# EAGLE schematic project (EAGLE 9.6.2)
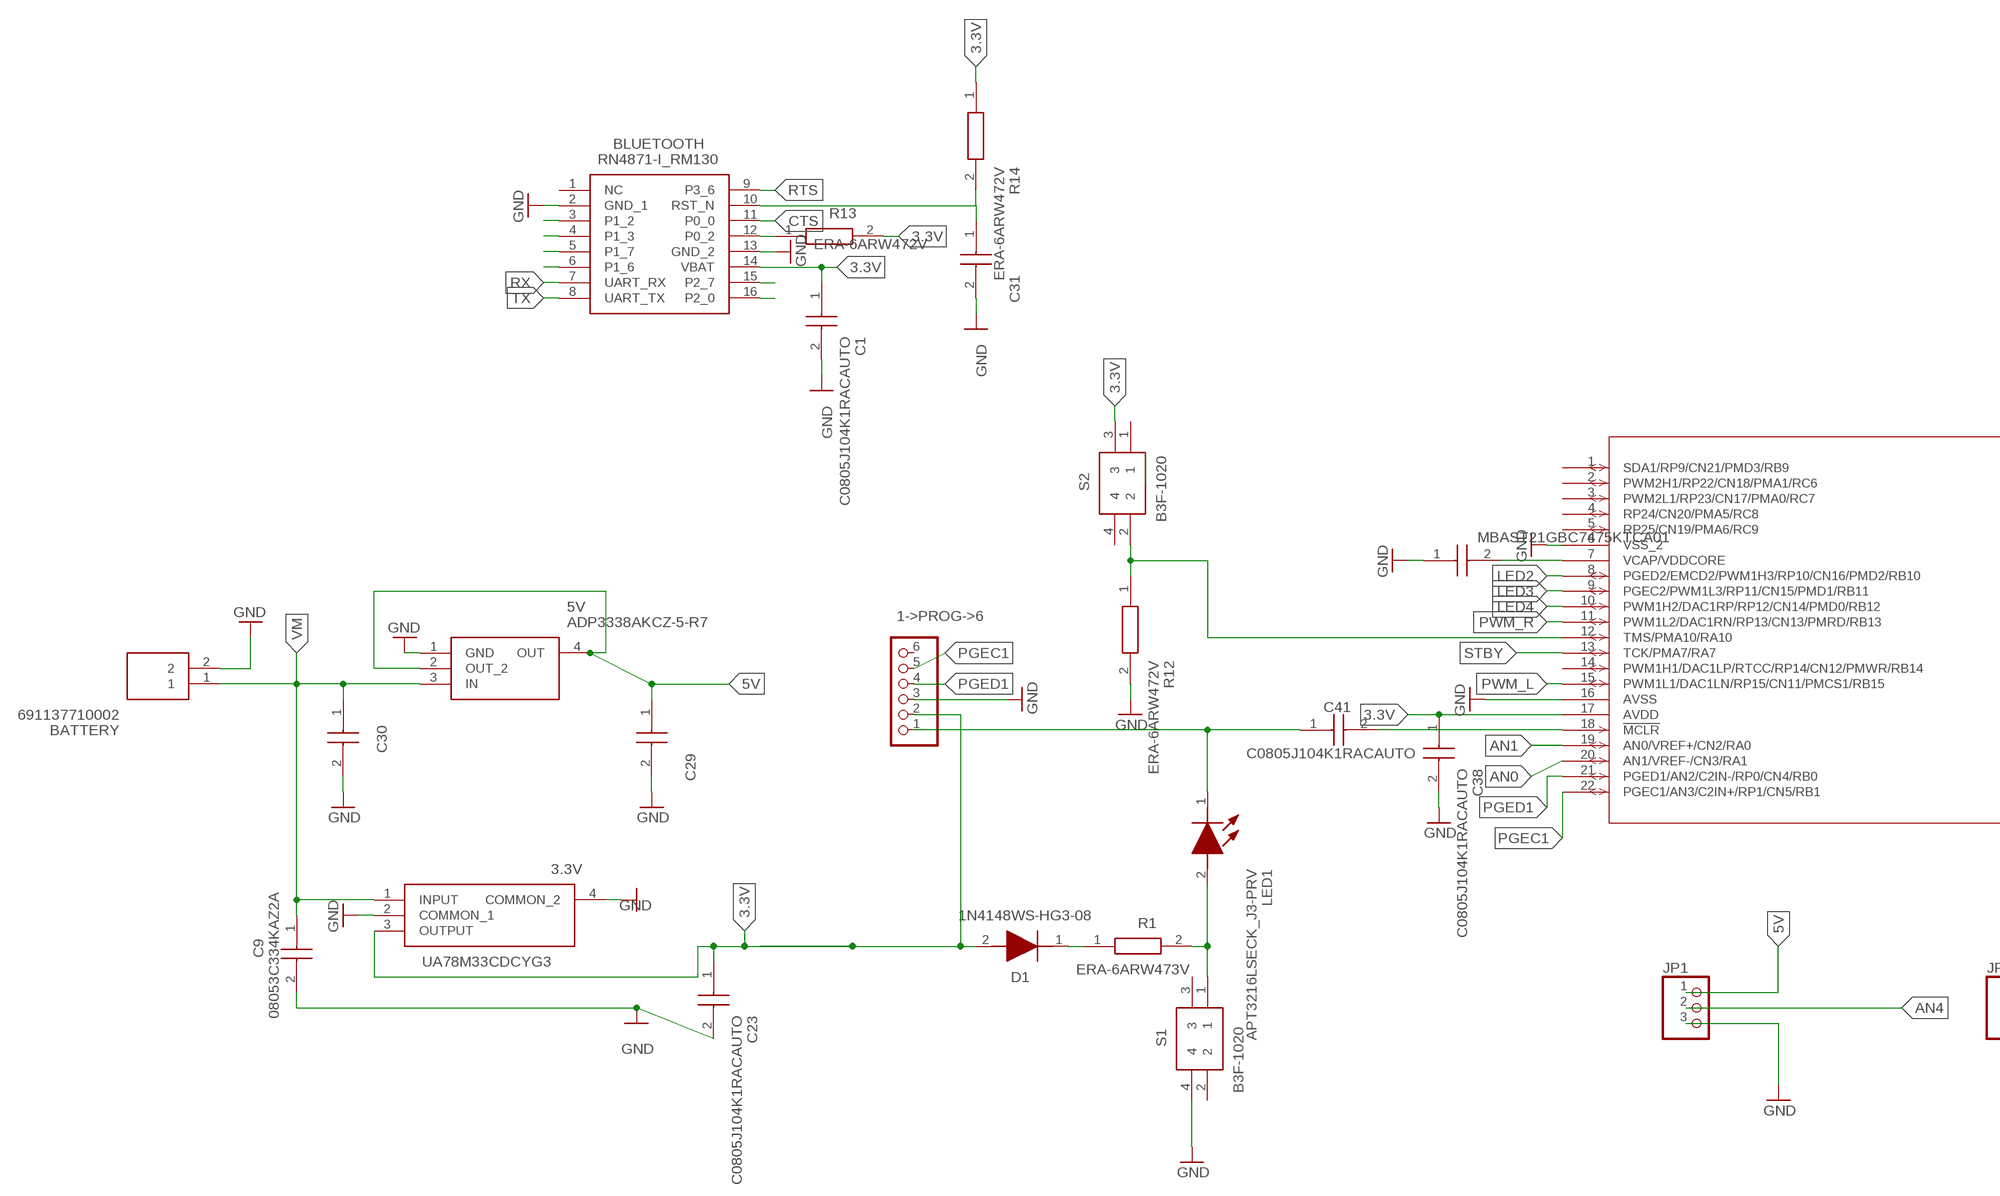
[diagram p0: schematic, sheet 1, part 1 of 2]
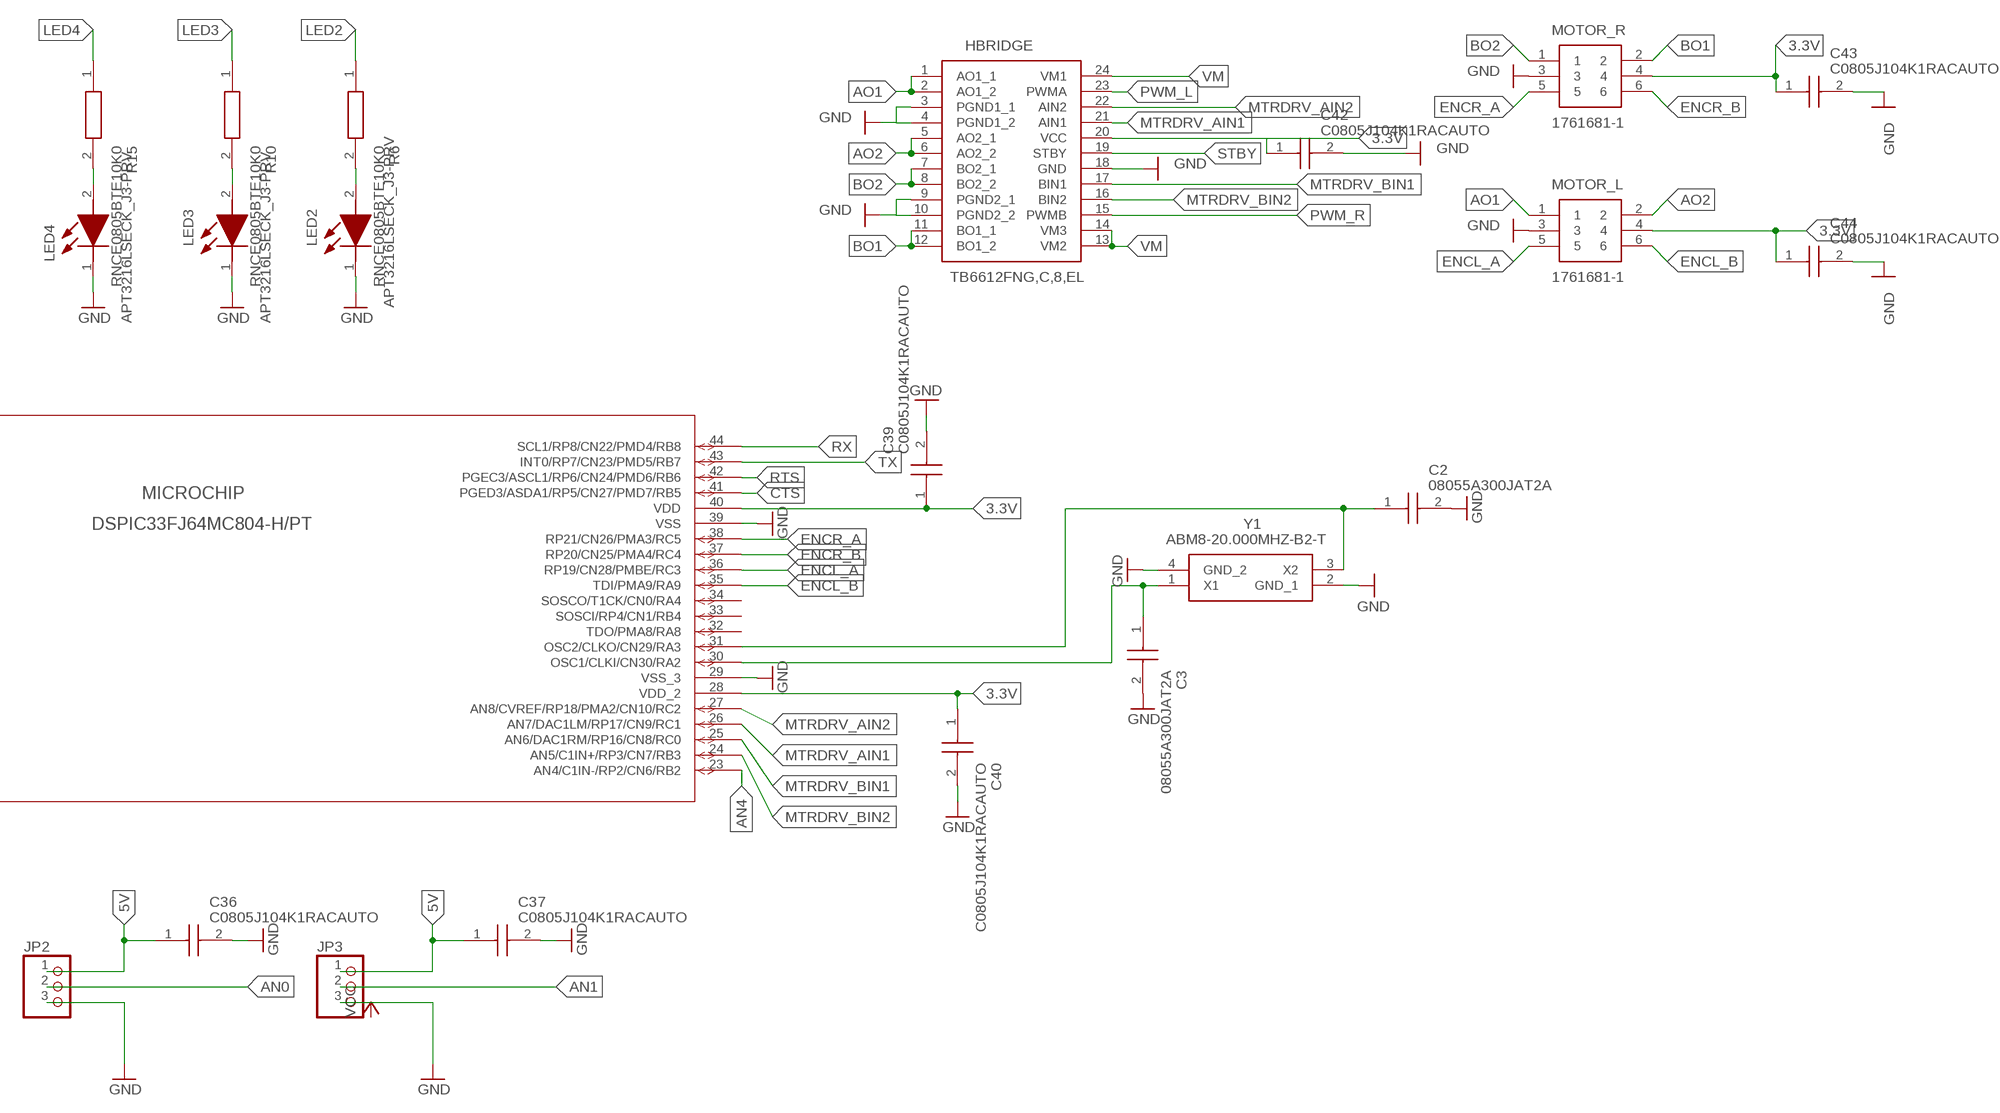
[diagram p1: schematic, sheet 1, part 2 of 2]

## Parts
1->PROG->6  PINHD-1X6  [1X06]
3.3V  UA78M33CDCYG3  [SOT230P700X180-4N]
5V  ADP3338AKCZ-5-R7  [SOT230P700X180-4N]
BATTERY  691137710002  [SHDR2W70P0X500_1X2_1000X750X11]
BLUETOOTH  RN4871-I_RM130  [RN4871]
C1  C0805J104K1RACAUTO  [CAPC2012X140N]
C2  08055A300JAT2A  [CAPC2012X94N]
C3  08055A300JAT2A  [CAPC2012X94N]
C4  MBAST21GBC7475KTCA01  [CAPC2114X145N]
C9  08053C334KAZ2A  [CAPC2012X152N]
C23  C0805J104K1RACAUTO  [CAPC2012X140N]
C29  C0805J104K1RACAUTO  [CAPC2012X140N]
C30  1µF  C0805J104K1RACAUTO  [CAPC2012X140N]
C31  C0805J104K1RACAUTO  [CAPC2012X140N]
C36  C0805J104K1RACAUTO  [CAPC2012X140N]
C37  C0805J104K1RACAUTO  [CAPC2012X140N]
C38  C0805J104K1RACAUTO  [CAPC2012X140N]
C39  C0805J104K1RACAUTO  [CAPC2012X140N]
C40  C0805J104K1RACAUTO  [CAPC2012X140N]
C41  C0805J104K1RACAUTO  [CAPC2012X140N]
C42  C0805J104K1RACAUTO  [CAPC2012X140N]
C43  C0805J104K1RACAUTO  [CAPC2012X140N]
C44  C0805J104K1RACAUTO  [CAPC2012X140N]
D1  1N4148WS-HG3-08  [SOD2713X115N]
HBRIDGE  TB6612FNG,C,8,EL  [SOP65P760X160-24N]
JP1  PINHD-1X3  [1X03]
JP2  PINHD-1X3  [1X03]
JP3  PINHD-1X3  [1X03]
LED1  APT3216LSECK_J3-PRV  [LEDC3216X95N]
LED2  APT3216LSECK_J3-PRV  [LEDC3216X95N]
LED3  APT3216LSECK_J3-PRV  [LEDC3216X95N]
LED4  APT3216LSECK_J3-PRV  [LEDC3216X95N]
MICROCHIP  DSPIC33FJ64MC804-H/PT  [TQFP44_10X10MC_MCH]
MOTOR_L  1761681-1  [SHDR6W67P254_2X3_1524X916X922P]
MOTOR_R  1761681-1  [SHDR6W67P254_2X3_1524X916X922P]
R1  ERA-6ARW473V  [ERA6AEB101V]
R6  RNCE0805BTE10K0  [RESC2012X65N]
R10  RNCE0805BTE10K0  [RESC2012X65N]
R12  ERA-6ARW472V  [ERA6AEB101V]
R13  ERA-6ARW472V  [ERA6AEB101V]
R14  ERA-6ARW472V  [ERA6AEB101V]
R15  RNCE0805BTE10K0  [RESC2012X65N]
S1  B3F-1020  [B3F1000]
S2  B3F-1020  [B3F1000]
Y1  ABM8-20.000MHZ-B2-T  [ABM810000MHZ12D2W]

## Nets
3.3V: 1->PROG->6.2 3.3V.3(OUTPUT) BLUETOOTH.14(VBAT) C1.1 C23.1 C38.1 C39.1 C40.1 C42.1 C43.1 C44.1 D1.2(A) HBRIDGE.20(VCC) MICROCHIP.17(AVDD) MICROCHIP.28(VDD_2) MICROCHIP.40(VDD) MOTOR_L.4 MOTOR_R.4 R13.2 R14.1 S2.3
5V: 5V.2(OUT_2) 5V.4(OUT) C29.1 C36.1 C37.1 JP1.1 JP2.1 JP3.1
AN0: JP2.2 MICROCHIP.20(AN1/VREF-/CN3/RA1)
AN1: JP3.2 MICROCHIP.19(AN0/VREF+/CN2/RA0)
AN4: JP1.2 MICROCHIP.23(AN4/C1IN-/RP2/CN6/RB2)
AO1: HBRIDGE.1(AO1_1) HBRIDGE.2(AO1_2) MOTOR_L.1
AO2: HBRIDGE.5(AO2_1) HBRIDGE.6(AO2_2) MOTOR_L.2
BO1: HBRIDGE.11(BO1_1) HBRIDGE.12(BO1_2) MOTOR_R.2
BO2: HBRIDGE.7(BO2_1) HBRIDGE.8(BO2_2) MOTOR_R.1
CTS: BLUETOOTH.11(P0_0) MICROCHIP.41(PGED3/ASDA1/RP5/CN27/PMD7/RB5)
ENCL_A: MICROCHIP.36(RP19/CN28/PMBE/RC3) MOTOR_L.5
ENCL_B: MICROCHIP.35(TDI/PMA9/RA9) MOTOR_L.6
ENCR_A: MICROCHIP.38(RP21/CN26/PMA3/RC5) MOTOR_R.5
ENCR_B: MICROCHIP.37(RP20/CN25/PMA4/RC4) MOTOR_R.6
GND: 1->PROG->6.3 3.3V.2(COMMON_1) 3.3V.4(COMMON_2) 5V.1(GND) BATTERY.2 BLUETOOTH.2(GND_1) BLUETOOTH.13(GND_2) C1.2 C2.2 C3.2 C4.1 C9.2 C23.2 C29.2 C30.2 C31.2 C36.2 C37.2 C38.2 C39.2 C40.2 C42.2 C43.2 C44.2 HBRIDGE.3(PGND1_1) HBRIDGE.4(PGND1_2) HBRIDGE.9(PGND2_1) HBRIDGE.10(PGND2_2) HBRIDGE.18(GND) JP1.3 JP2.3 JP3.3 LED2.1(K) LED3.1(K) LED4.1(K) MICROCHIP.6(VSS_2) MICROCHIP.16(AVSS) MICROCHIP.29(VSS_3) MICROCHIP.39(VSS) MOTOR_L.3 MOTOR_R.3 R12.2 S1.4 Y1.2(GND_1) Y1.4(GND_2)
LED2: MICROCHIP.8(PGED2/EMCD2/PWM1H3/RP10/CN16/PMD2/RB10) R6.1
LED3: MICROCHIP.9(PGEC2/PWM1L3/RP11/CN15/PMD1/RB11) R10.1
LED4: MICROCHIP.10(PWM1H2/DAC1RP/RP12/CN14/PMD0/RB12) R15.1
MTRDRV_AIN1: HBRIDGE.21(AIN1) MICROCHIP.26(AN7/DAC1LM/RP17/CN9/RC1)
MTRDRV_AIN2: HBRIDGE.22(AIN2) MICROCHIP.27(AN8/CVREF/RP18/PMA2/CN10/RC2)
MTRDRV_BIN1: HBRIDGE.17(BIN1) MICROCHIP.25(AN6/DAC1RM/RP16/CN8/RC0)
MTRDRV_BIN2: HBRIDGE.16(BIN2) MICROCHIP.24(AN5/C1IN+/RP3/CN7/RB3)
N$1: C2.1 MICROCHIP.31(OSC2/CLKO/CN29/RA3) Y1.3(X2)
N$2: C3.1 MICROCHIP.30(OSC1/CLKI/CN30/RA2) Y1.1(X1)
N$5: D1.1(K) R1.1
N$6: LED4.2(A) R15.2
N$7: C4.2 MICROCHIP.7(VCAP/VDDCORE)
N$9: 1->PROG->6.1 C41.1 LED1.1(K)
N$10: LED3.2(A) R10.2
N$11: LED2.2(A) R6.2
N$12: LED1.2(A) R1.2 S1.1
N$13: C41.2 MICROCHIP.18(!MCLR)
N$16: MICROCHIP.12(TMS/PMA10/RA10) R12.1 S2.2
N$20: BLUETOOTH.3(P1_2)
N$21: BLUETOOTH.4(P1_3)
N$22: BLUETOOTH.5(P1_7)
N$23: BLUETOOTH.6(P1_6)
N$25: BLUETOOTH.10(RST_N) C31.1 R14.2
N$27: BLUETOOTH.12(P0_2) R13.1
N$31: BLUETOOTH.15(P2_7)
N$32: BLUETOOTH.16(P2_0)
PGEC1: 1->PROG->6.5 MICROCHIP.22(PGEC1/AN3/C2IN+/RP1/CN5/RB1)
PGED1: 1->PROG->6.4 MICROCHIP.21(PGED1/AN2/C2IN-/RP0/CN4/RB0)
PWM_L: HBRIDGE.23(PWMA) MICROCHIP.15(PWM1L1/DAC1LN/RP15/CN11/PMCS1/RB15)
PWM_R: HBRIDGE.15(PWMB) MICROCHIP.11(PWM1L2/DAC1RN/RP13/CN13/PMRD/RB13)
RTS: BLUETOOTH.9(P3_6) MICROCHIP.42(PGEC3/ASCL1/RP6/CN24/PMD6/RB6)
RX: BLUETOOTH.7(UART_RX) MICROCHIP.44(SCL1/RP8/CN22/PMD4/RB8)
STBY: HBRIDGE.19(STBY) MICROCHIP.13(TCK/PMA7/RA7)
TX: BLUETOOTH.8(UART_TX) MICROCHIP.43(INT0/RP7/CN23/PMD5/RB7)
VM: 3.3V.1(INPUT) 5V.3(IN) BATTERY.1 C9.1 C30.1 HBRIDGE.13(VM2) HBRIDGE.14(VM3) HBRIDGE.24(VM1)
Unconnected: 1->PROG->6.6 BLUETOOTH.1(NC) MICROCHIP.1(SDA1/RP9/CN21/PMD3/RB9) MICROCHIP.2(PWM2H1/RP22/CN18/PMA1/RC6) MICROCHIP.3(PWM2L1/RP23/CN17/PMA0/RC7) MICROCHIP.4(RP24/CN20/PMA5/RC8) MICROCHIP.5(RP25/CN19/PMA6/RC9) MICROCHIP.14(PWM1H1/DAC1LP/RTCC/RP14/CN12/PMWR/RB14) MICROCHIP.32(TDO/PMA8/RA8) MICROCHIP.33(SOSCI/RP4/CN1/RB4) MICROCHIP.34(SOSCO/T1CK/CN0/RA4) S1.2 S1.3 S2.1 S2.4

## Library data of the parts
1->PROG->6 = pinhead:PINHD-1X6: PIN HEADER
3.3V = UA78M33CDCYG3:UA78M33CDCYG3: Linear Voltage Regulators 3.3 V 500mA Fix Pos Voltage Regulator Source: Datasheet <http://www.ti.com/lit/ds/symlink/ua78m.pdf>; DESCRIPTION: Linear Voltage Regulators 3.3 V 500mA Fix Pos Voltage Regulator; HEIGHT: 1.8mm; MANUFACTURER_NAME: Texas Instruments; MANUFACTURER_PART_NUMBER: UA78M33CDCYG3; MOUSER_PART_NUMBER: 595-UA78M33CDCYG3; MOUSER_PRICE-STOCK: https://www.mouser.co.uk/ProductDetail/Texas-Instruments/UA78M33CDCYG3?qs=0O%2FZFlpUpJU0kFSZAC76Kw%3D%3D
5V = ADP3338AKCZ-5-R7:ADP3338AKCZ-5-R7: Analog Devices ADP3338AKCZ-5-R7, LDO Voltage Regulator, 1A, 5 V +/-1.6%, 2.7 8 Vin, 3-Pin SOT-223 Source: Datasheet; DESCRIPTION: Analog Devices ADP3338AKCZ-5-R7, LDO Voltage Regulator, 1A, 5 V +/-1.6%, 2.7 8 Vin, 3-Pin SOT-223; HEIGHT: mm; MANUFACTURER_NAME: Analog Devices; MANUFACTURER_PART_NUMBER: ADP3338AKCZ-5-R7; MOUSER_PART_NUMBER: 584-ADP3338AKCZ-5-R7; MOUSER_PRICE-STOCK: https://www.mouser.co.uk/ProductDetail/Analog-Devices/ADP3338AKCZ-5-R7?qs=WIvQP4zGangs6Tv%252BSE3hsA%3D%3D
BATTERY = 691137710002:691137710002: Wurth Elektronik WR-TBL Series 5mm Pitch, 2 Way, PCB Terminal Block, Through Hole Source: Datasheet <https://katalog.we-online.com/em/datasheet/691137710002.pdf>; DESCRIPTION: Wurth Elektronik WR-TBL Series 5mm Pitch, 2 Way, PCB Terminal Block, Through Hole; HEIGHT: 11.6mm; MANUFACTURER_NAME: Wurth Elektronik; MANUFACTURER_PART_NUMBER: 691137710002; MOUSER_PART_NUMBER: 710-691137710002; MOUSER_PRICE-STOCK: https://www.mouser.co.uk/ProductDetail/Wurth-Elektronik/691137710002?qs=lBTPRtX1sU9LnHBbviNKGA%3D%3D
BLUETOOTH = RN4871-I_RM130:RN4871-I_RM130: Bluetooth BLE Module, Shielded, Antenna, Source: Datasheet <http://ww1.microchip.com/downloads/en/DeviceDoc/50002489C.pdf>; DESCRIPTION: Bluetooth BLE Module, Shielded, Antenna,; HEIGHT: mm; MANUFACTURER_NAME: Microchip; MANUFACTURER_PART_NUMBER: RN4871-I/RM130; MOUSER_PART_NUMBER: 579-RN4871IRM130; MOUSER_PRICE-STOCK: https://www.mouser.co.uk/ProductDetail/Microchip-Technology/RN4871-I-RM130?qs=MLItCLRbWswoZsrzvVbGYw%3D%3D
C1 C23 C29-C31 C36-C44 = C0805J104K1RACAUTO:C0805J104K1RACAUTO: SMD Auto X7R FO, Ceramic, 0.1 uF, 10%, 100 VDC, X7R, SMD, MLCC, Open Mode, Automotive Grade, 0805, 0.6 mm Source: Datasheet <https://search.kemet.com/component-documentation/download/specsheet/C0805J104K1RACAUTO>; DESCRIPTION: SMD Auto X7R FO, Ceramic, 0.1 uF, 10%, 100 VDC, X7R, SMD, MLCC, Open Mode, Automotive Grade, 0805, 0.6 mm; HEIGHT: 1.4mm; MANUFACTURER_NAME: KEMET; MANUFACTURER_PART_NUMBER: C0805J104K1RACAUTO
C2 C3 = 08055A300JAT2A:08055A300JAT2A: Multilayer Ceramic Capacitors MLCC - SMD/SMT 50V 30pF C0G 0805 5% Source: Datasheet <https://componentsearchengine.com/Datasheets/1/08055A300JAT2A.pdf>; DESCRIPTION: Multilayer Ceramic Capacitors MLCC - SMD/SMT 50V 30pF C0G 0805 5%; HEIGHT: 0.94mm; MANUFACTURER_NAME: Kyocera AVX; MANUFACTURER_PART_NUMBER: 08055A300JAT2A; MOUSER_PART_NUMBER: 581-08055A300J; MOUSER_PRICE-STOCK: https://www.mouser.com/Search/Refine.aspx?Keyword=581-08055A300J
C4 = MBAST21GBC7475KTCA01:MBAST21GBC7475KTCA01: 4.7 F +/-10% 25V Ceramic Capacitor X7S 0805 (2012 Metric) Source: Datasheet <https://ds.yuden.co.jp/TYCOMPAS/eu/detail?pn=MBAST21GBC7475KTCA01&u=I>; DESCRIPTION: 4.7 F +/-10% 25V Ceramic Capacitor X7S 0805 (2012 Metric); HEIGHT: 1.45mm; MANUFACTURER_NAME: TAIYO YUDEN; MANUFACTURER_PART_NUMBER: MBAST21GBC7475KTCA01
C9 = 08053C334KAZ2A:08053C334KAZ2A: AVX 330nF Multilayer Ceramic Capacitor (MLCC) 25 V 0805 SMT Max. Op. Temp. +125C Source: Datasheet; DESCRIPTION: AVX 330nF Multilayer Ceramic Capacitor (MLCC) 25 V 0805 SMT Max. Op. Temp. +125C; HEIGHT: 1.52mm; MANUFACTURER_NAME: Kyocera AVX; MANUFACTURER_PART_NUMBER: 08053C334KAZ2A
D1 = 1N4148WS-HG3-08:1N4148WS-HG3-08: Diodes - General Purpose, Power, Switching 1V Vf, 4pF; 25nA Ir SOD-323 Source: Datasheet; DESCRIPTION: Diodes - General Purpose, Power, Switching 1V Vf, 4pF; 25nA Ir SOD-323; HEIGHT: 1.15mm; MANUFACTURER_NAME: Vishay; MANUFACTURER_PART_NUMBER: 1N4148WS-HG3-08; MOUSER_PART_NUMBER: 78-1N4148WS-HG3-08; MOUSER_PRICE-STOCK: https://www.mouser.co.uk/ProductDetail/Vishay-Semiconductors/1N4148WS-HG3-08?qs=MLItCLRbWsz%2FnO5zs5RZvA%3D%3D
HBRIDGE = TB6612FNG_C_8_EL:TB6612FNG,C,8,EL: otor / Motion / Ignition Controllers & Drivers Brush Motor Driver IC Source: Datasheet <http://toshiba.semicon-storage.com/info/docget.jsp?did=10660&prodName=TB6612FNG>; DESCRIPTION: otor / Motion / Ignition Controllers & Drivers Brush Motor Driver IC; HEIGHT: 1.6mm; MANUFACTURER_NAME: Toshiba; MANUFACTURER_PART_NUMBER: TB6612FNG,C,8,EL; MOUSER_PART_NUMBER: 757-TB6612FNGC8EL; MOUSER_PRICE-STOCK: https://www.mouser.co.uk/ProductDetail/Toshiba/TB6612FNGC8EL?qs=rsevcuukUAy2UalRuv4E%2FQ%3D%3D
JP1-JP3 = pinhead:PINHD-1X3: PIN HEADER
LED1-LED4 = APT3216LSECK_J3-PRV:APT3216LSECK_J3-PRV: 3.2X1.6mm Low Current Red SMD LED; Water Clear; 625nm; 120 Viewing Angle Source: Datasheet <https://componentsearchengine.com/Datasheets/1/APT3216LSECK_J3-PRV.pdf>; DESCRIPTION: 3.2X1.6mm Low Current Red SMD LED; Water Clear; 625nm; 120 Viewing Angle; HEIGHT: 0.95mm; MANUFACTURER_NAME: Kingbright; MANUFACTURER_PART_NUMBER: APT3216LSECK/J3-PRV; MOUSER_PART_NUMBER: 604-APT3216LSECKJ3RV; MOUSER_PRICE-STOCK: https://www.mouser.co.uk/ProductDetail/Kingbright/APT3216LSECK-J3-PRV?qs=6oMev5NRZMH6FCB40E9NQw%3D%3D
MICROCHIP = DSPIC33FJ64MC804-H_PT:DSPIC33FJ64MC804-H/PT; COPYRIGHT: Copyright (C) 2025 Ultra Librarian. All rights reserved.; MANUFACTURER_NAME: Microchip; MANUFACTURER_PART_NUMBER: DSPIC33FJ64MC804-H/PT
MOTOR_L MOTOR_R = 1761681-1:1761681-1: Body Features: Primary Product Color Black | Connector Profile Low | Daisy Chain With | Configuration Features: PCB Mount Orientation Vertical | Number of Positions 6 | Number of Rows 2 | Contact Features: Contact Mating Area Plating Material Thickness 15 MICIN | Contact Type Pin | PCB Contact Termination Area Plating Material Tin | Contact Base Material Phosphor Bronze | PCB Contact Termination Area Plating Material Thickness 100 MICIN | Contact Current Rating (Max) 1 AMP | Contact Underplating Material Ni Source: Datasheet <https://www.te.com/commerce/DocumentDelivery/DDEController?Action=showdoc&DocId=Customer Drawing1761681A1pdfEnglishENG_CD_1761681_A1.pdf1761681-1>; DESCRIPTION: Body Features: Primary Product Color Black | Connector Profile Low | Daisy Chain With | Configuration Features: PCB Mount Orientation Vertical | Number of Positions 6 | Number of Rows 2 | Contact Features: Contact Mating Area Plating Material Thickness 15 MICIN | Contact Type Pin | PCB Contact Termination Area Plating Material Tin | Contact Base Material Phosphor Bronze | PCB Contact Termination Area Plating Material Thickness 100 MICIN | Contact Current Rating (Max) 1 AMP | Contact Underplating Material Ni; HEIGHT: 9.22mm; MANUFACTURER_NAME: TE Connectivity; MANUFACTURER_PART_NUMBER: 1761681-1; MOUSER_PART_NUMBER: 571-1761681-1; MOUSER_PRICE-STOCK: https://www.mouser.co.uk/ProductDetail/TE-Connectivity/1761681-1?qs=BqFpTYCQ3dLAeZ2wzdz7aw%3D%3D
R1 = ERA-6ARW473V:ERA-6ARW473V: Thin Film Resistors - SMD 0805 47Kohm 0.05% 10ppm AEC-Q200 Source: Datasheet <https://industrial.panasonic.com/cdbs/www-data/pdf/RDM0000/AOA0000C307.pdf>; DESCRIPTION: Thin Film Resistors - SMD 0805 47Kohm 0.05% 10ppm AEC-Q200; HEIGHT: 0.6mm; MANUFACTURER_NAME: Panasonic; MANUFACTURER_PART_NUMBER: ERA-6ARW473V; MOUSER_PART_NUMBER: 667-ERA-6ARW473V; MOUSER_PRICE-STOCK: https://www.mouser.co.uk/ProductDetail/Panasonic/ERA-6ARW473V?qs=ob%252BdNz2%252BYEhPt1EjoyLPGQ%3D%3D
R6 R10 R15 = RNCE0805BTE10K0:RNCE0805BTE10K0: Thin Film Resistors - SMD 10KOhms 0805 25ppm 1/8W 150V 0.1% Hi Temp/Stability Source: Datasheet <https://www.mouser.sg/datasheet/2/418/9/ENG_DS_9_1773463_9_B-3355380.pdf>; DESCRIPTION: Thin Film Resistors - SMD 10KOhms 0805 25ppm 1/8W 150V 0.1% Hi Temp/Stability; HEIGHT: 0.65mm; MANUFACTURER_NAME: Stackpole Electronics, Inc.; MANUFACTURER_PART_NUMBER: RNCE0805BTE10K0
R12-R14 = ERA-6ARW472V:ERA-6ARW472V: Thin Film Resistors - SMD 0805 4.7Kohm 0.05% 10ppm AEC-Q200 Source: Datasheet <https://industrial.panasonic.com/cdbs/www-data/pdf/RDM0000/AOA0000C307.pdf>; DESCRIPTION: Thin Film Resistors - SMD 0805 4.7Kohm 0.05% 10ppm AEC-Q200; HEIGHT: 0.6mm; MANUFACTURER_NAME: Panasonic; MANUFACTURER_PART_NUMBER: ERA-6ARW472V; MOUSER_PART_NUMBER: 667-ERA-6ARW472V; MOUSER_PRICE-STOCK: https://www.mouser.co.uk/ProductDetail/Panasonic/ERA-6ARW472V?qs=ob%252BdNz2%252BYEgbYp9qzrbNPA%3D%3D
S1 S2 = B3F-1020:B3F-1020: Switch Tact SPST,flat 5mm act,PC Pins Black Plunger Tactile Switch, SPST-NO 0.05 A@ 24 V dc 0.9mm Source: Datasheet <http://www.omron.com/ecb/products/pdf/en-b3f.pdf>; DESCRIPTION: Switch Tact SPST,flat 5mm act,PC Pins Black Plunger Tactile Switch, SPST-NO 0.05 A@ 24 V dc 0.9mm; HEIGHT: mm; MANUFACTURER_NAME: Omron Electronics; MANUFACTURER_PART_NUMBER: B3F-1020; MOUSER_PART_NUMBER: 653-B3F-1020; MOUSER_PRICE-STOCK: https://www.mouser.co.uk/ProductDetail/Omron-Electronics/B3F-1020?qs=lK7M36XCk6J1%2FfWxwEHrqA%3D%3D
Y1 = ABM8-20.000MHZ-B2-T:ABM8-20.000MHZ-B2-T: 20 MHz +/-20ppm Crystal 18pF 50 Ohms 4-SMD, No Lead Source: Datasheet <https://abracon.com/Resonators/abm8.pdf>; DESCRIPTION: 20 MHz +/-20ppm Crystal 18pF 50 Ohms 4-SMD, No Lead; HEIGHT: 0.8mm; MANUFACTURER_NAME: ABRACON; MANUFACTURER_PART_NUMBER: ABM8-20.000MHZ-B2-T; MOUSER_PART_NUMBER: 815-ABM8-20-B2-T; MOUSER_PRICE-STOCK: https://www.mouser.co.uk/ProductDetail/ABRACON/ABM8-20000MHZ-B2-T?qs=zLkLEWnxMJwLicGB81opDg%3D%3D